# EAGLE design miniFlyportProgrammer (EAGLE 6.4)
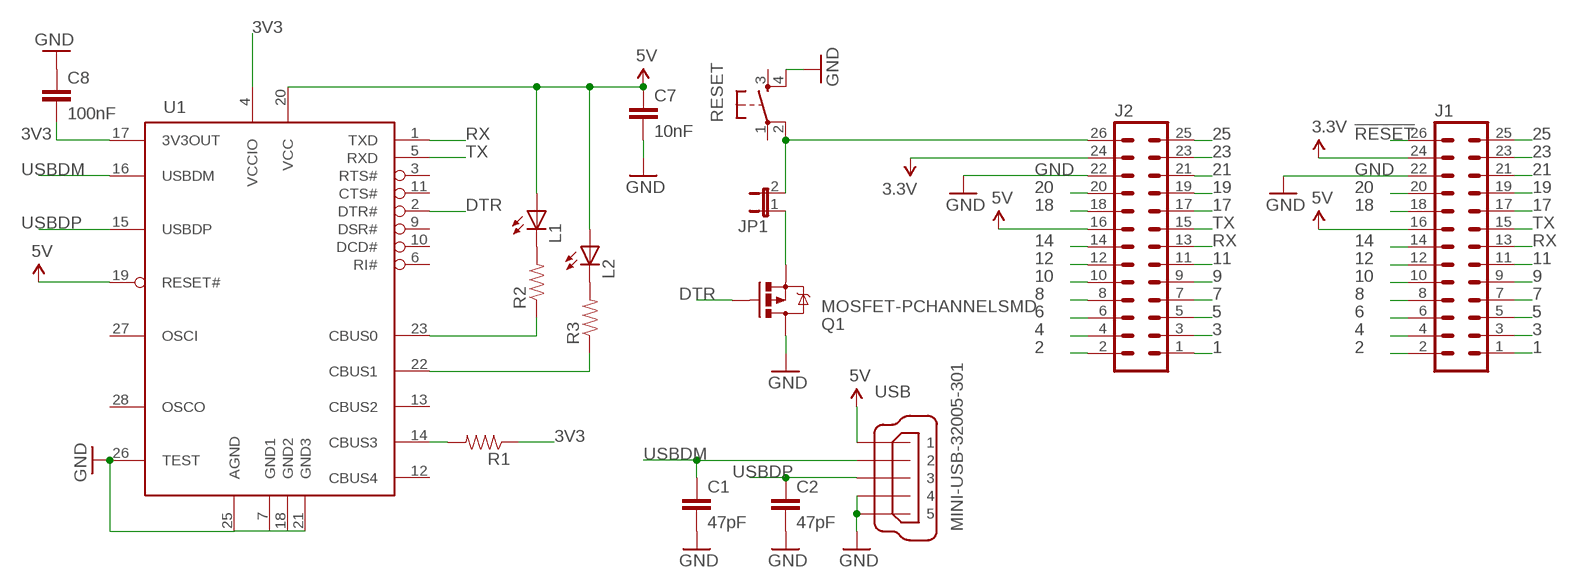
[diagram p0: schematic, sheet 1]

## Parts
C1  47pF  C-EUC0603  [C0603]
C2  47pF  C-EUC0603  [C0603]
C7  10nF  C-EUC0603  [C0603]
C8  100nF  C-EUC0603  [C0603]
J1  MA13-2  [MA13-2]
J2  MA13-2  [MA13-2]
JP1  JUMPER-2PTH  [1X02]
L1  LED0603  [LED-0603]
L2  LED0603  [LED-0603]
Q1  MOSFET-PCHANNELSMD  [SOT23-3]
R1  RESISTOR0603-RES  [0603-RES]
R2  RESISTOR0603-RES  [0603-RES]
R3  RESISTOR0603-RES  [0603-RES]
RESET  TAC_SWITCHSMD  [TACTILE_SWITCH_SMD]
U1  FT232RL  [SSOP28DB]
USB  MINI-USB-32005-301  [32005-301]

## Nets
1: J1.1 J2.1
2: J1.2 J2.2
3: J1.3 J2.3
3.3V: J1.24 J2.24
3V3: C8.2 R1.1 U1.4(VCCIO) U1.17(3V3OUT)
4: J1.4 J2.4
5: J1.5 J2.5
5V: C7.1 J1.16 J2.16 L1.A L2.A U1.19(RESET#) U1.20(VCC) USB.1
6: J1.6 J2.6
7: J1.7 J2.7
8: J1.8 J2.8
9: J1.9 J2.9
10: J1.10 J2.10
11: J1.11 J2.11
12: J1.12 J2.12
14: J1.14 J2.14
17: J1.17 J2.17
18: J1.18 J2.18
19: J1.19 J2.19
20: J1.20 J2.20
21: J1.21 J2.21
23: J1.23 J2.23
25: J1.25 J2.25
!RESET: J1.26 J2.26 JP1.2 RESET.2
DTR: Q1.1(G) U1.2(DTR#)
GND: C1.2 C2.2 C7.2 C8.1 J1.22 J2.22 Q1.3(D) RESET.4 U1.7(GND1) U1.18(GND2) U1.21(GND3) U1.25(AGND) U1.26(TEST) USB.4 USB.5
N$1: JP1.1 Q1.2(S)
N$5: L1.C R2.2
N$6: L2.C R3.2
N$8: R1.2 U1.14(CBUS3)
N$13: R2.1 U1.23(CBUS0)
N$15: R3.1 U1.22(CBUS1)
RX: J1.13 J2.13 U1.1(TXD)
TX: J1.15 J2.15 U1.5(RXD)
USBDM: C1.1 U1.16(USBDM) USB.2
USBDP: C2.1 U1.15(USBDP) USB.3
Unconnected: RESET.1 RESET.3 U1.3(RTS#) U1.6(RI#) U1.9(DSR#) U1.10(DCD#) U1.11(CTS#) U1.12(CBUS4) U1.13(CBUS2) U1.27(OSCI) U1.28(OSCO)

## Library data of the parts
C1 C2 C7 C8 = resistor:C-EU: CAPACITOR, European symbol
J1 J2 = con-lstb:MA13-2: PIN HEADER
JP1 = SparkFun-Passives:JUMPER-2: Jumper Basic 0.1" spaced jumper. Use with breakaway headers.
L1 L2 = SparkFun-LED:LED: LEDs Standard schematic elements and footprints for 5mm, 3mm, 1206, and 0603 sized LEDs. 5mm - Spark Fun Electronics SKU : COM-00529 (and others)
Q1 = SparkFun-DiscreteSemi:MOSFET-PCHANNEL: Generic PMOSFET
R1-R3 = SparkFun-Passives:RESISTOR: Resistor Basic schematic elements and footprints for 0603, 1206, and PTH resistors.
RESET = SparkFun-Electromechanical:TAC_SWITCH: Momentary Switch Button commonly used for reset or general input. Spark Fun Electronics SKU : COM-00097
U1 = ftdichip-4:FT232RL: USB UART 4th Generation USB UART (USB <-> Serial) Controller
USB = con-cypressindustries:MINI-USB-: MINI USB-B Conector Source: www.cypressindustries.com

## Board
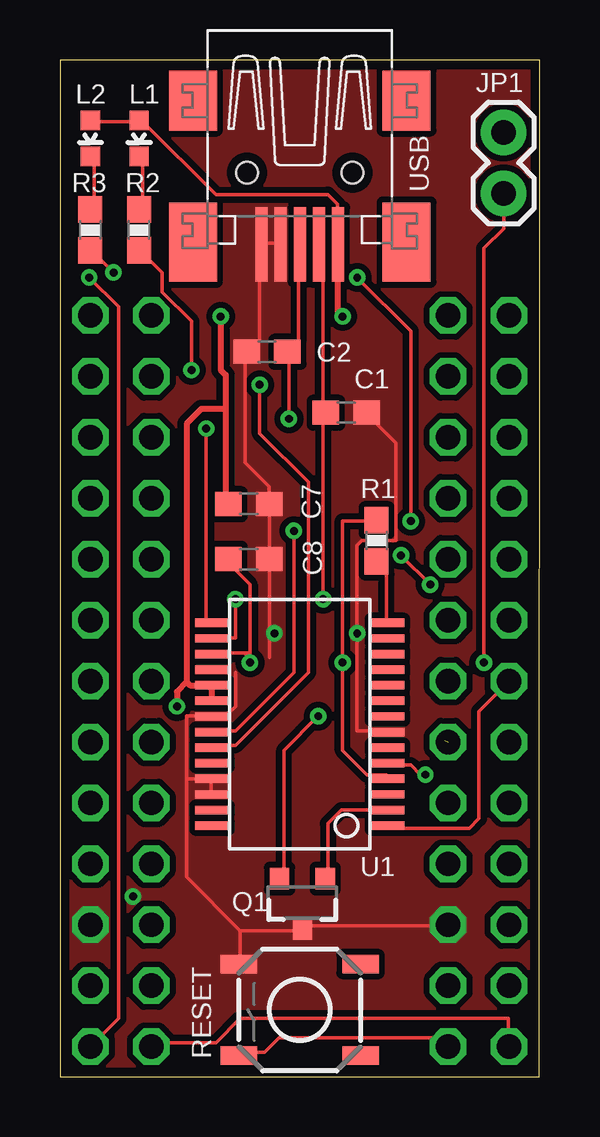
[diagram p1: board, top side]
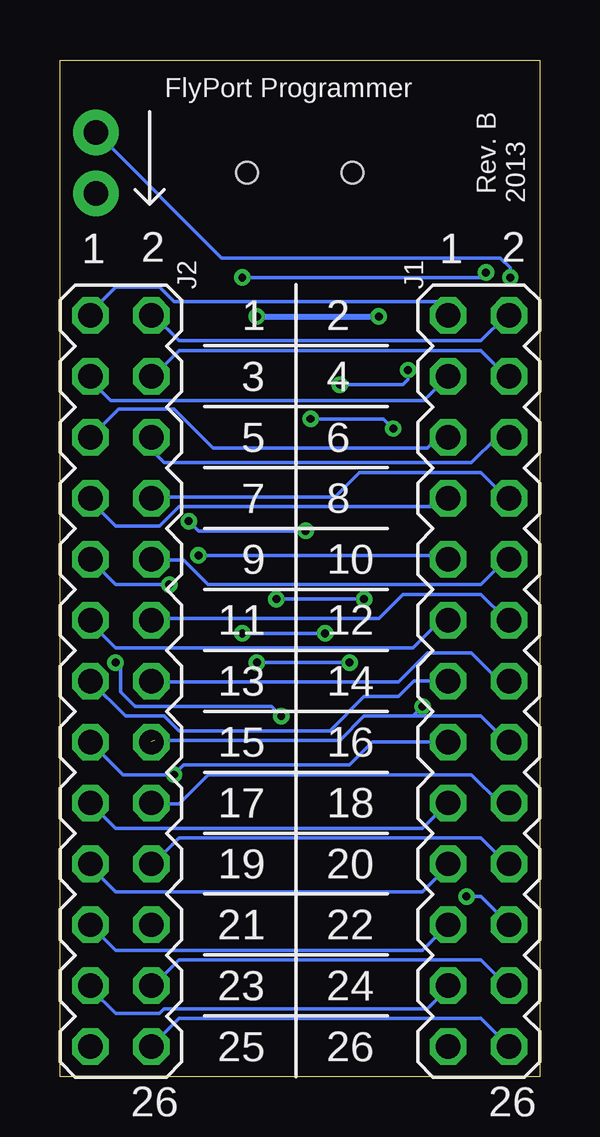
[diagram p2: board, bottom side, seen from below]

Size 20 x 42.39 mm. Coordinates in mm from the lower left corner, seen from the top.
Outline: 0,0 19.99,0 20,42.39 0,42.39 0,0
Copper layers (1*16): Top 0.0356mm / dielectric 1.5011mm / Bottom 0.0356mm
Design rules "LaenPCBOrder *": minimum track width 6mil, minimum drill 13mil, track to track 6mil, track to pad 6mil, pad to pad 6mil, via to via 6mil, smd to smd 6mil, copper to edge 15mil, drill to drill 6mil, minimum pad ring 7mil, minimum via ring 7mil, stop-mask expansion 4mil, vias tented up to drill 15mil, thermal gap 10mil

### Footprints (pad centres in the part's own frame; a part is rotated, then mirrored left to right if it is on the bottom)
C0603 = smd 1.1 x 1: 1 -0.85,0; 2 0.85,0
MA13-2 = drill 1.016 octagon: 1 -15.24,-1.27; 2 -15.24,1.27; 3 -12.7,-1.27; 4 -12.7,1.27; 5 -10.16,-1.27; 6 -10.16,1.27; 7 -7.62,-1.27; 8 -7.62,1.27; 9 -5.08,-1.27; 10 -5.08,1.27; 11 -2.54,-1.27; 12 -2.54,1.27; 13 0,-1.27; 14 0,1.27; 15 2.54,-1.27; 16 2.54,1.27; 17 5.08,-1.27; 18 5.08,1.27; 19 7.62,-1.27; 20 7.62,1.27; 21 10.16,-1.27; 22 10.16,1.27; 23 12.7,-1.27; 24 12.7,1.27; 25 15.24,-1.27; 26 15.24,1.27
1X02 = drill 1.016 pad 1.88: 1 0,0; 2 2.54,0
LED-0603 = smd 0.8 x 0.8: A 0,-0.75; C 0,0.75
SOT23-3 = smd 0.8 x 0.9: 1 -0.95,-1; 2 0.95,-1; 3 0,1.1
0603-RES = smd 1.1 x 1: 1 -0.85,0; 2 0.85,0
TACTILE_SWITCH_SMD = smd 1.524 x 0.762: 1 -2.54,1.905; 2 2.54,1.905; 3 -2.54,-1.905; 4 2.54,-1.905
SSOP28DB = smd 0.348 x 1.397: 1 -4.225,-3.656; 2 -3.575,-3.656; 3 -2.925,-3.656; 4 -2.275,-3.656; 5 -1.625,-3.656; 6 -0.975,-3.656; 7 -0.325,-3.656; 8 0.325,-3.656; 9 0.975,-3.656; 10 1.625,-3.656; 11 2.275,-3.656; 12 2.925,-3.656; 13 3.575,-3.656; 14 4.225,-3.656; 15 4.225,3.656; 16 3.575,3.656; 17 2.925,3.656; 18 2.275,3.656; 19 1.625,3.656; 20 0.975,3.656; 21 0.325,3.656; 22 -0.325,3.656; 23 -0.975,3.656; 24 -1.625,3.656; 25 -2.275,3.656; 26 -2.925,3.656; 27 -3.575,3.656; 28 -4.225,3.656
32005-301 = smd 3.1 x 0.5: 1 3,1.6; 2 3,0.8; 3 3,0; 4 3,-0.8; 5 3,-1.6 | smd 2.5 x 2: M1 -3,-4.45; M2 -3,4.45 | smd 3.3 x 2: M3 2.9,4.45; M4 2.9,-4.45 | hole 0.9: 0,2.2; 0,-2.2

### Placement (x,y rotation side)
C1  11.94,27.69 0 top
C2  8.64,30.23 180 top
C7  7.87,23.88 0 top
C8  7.87,21.59 180 top
J1  2.54,16.5 270 bottom
J2  17.46,16.5 270 bottom
JP1  18.5,36.83 90 top
L1  3.3,39.12 180 top
L2  1.27,39.12 180 top
Q1  10.11,7.26 180 top
R1  13.21,22.35 270 top
R2  3.3,35.31 90 top
R3  1.27,35.31 90 top
RESET  10,2.79 180 top
U1  10,14.7 90 top
USB  10,37.7 270 top

### Tracks (layer width: path | path; a pad name or v marks a point on that pad's centre or on a via)
1
  Bottom 0.152: J1.1 3.86,31.9 4.27,32.31 15.24,32.31 15.85,32.92 17.68,32.92 18.69,31.9 J2.1
2
  Bottom 0.152: J1.2 1.42,31.7 2.44,30.68 15.04,30.68 16.05,31.7 J2.2
3
  Bottom 0.152: J1.3 4.76,28.25 4.76,28.19 17.88,28.19 18.73,29.04 J2.3
3.3V
  Bottom 0.152: J1.24 1.42,3.86 2.44,4.88 15.04,4.88 16.05,3.86 J2.24
3V3  (via drill 0.33)
  Top 0.152: 7.72,17.68 6.5,17.68 U1.17 | C8.2 7.11,21.54 7.11,21.34 7.92,20.52 v7.92,17.27 7.72,17.68 | R1.1 13.21,23.16 11.79,23.16 v11.79,17.27 11.79,13.61 12.8,12.6 13.61,12.6 U1.4 | 7.92,17.68 7.72,17.68
  Bottom 0.152: v11.79,17.27 v7.92,17.27
4
  Bottom 0.152: J1.4 1.42,29.26 2.44,30.28 15.04,30.28 16.05,29.26 J2.4
5
  Bottom 0.152: J1.5 4.23,26.66 4.67,26.21 13.61,26.21 15.24,27.84 17.55,27.84 J2.5
5V  (via drill 0.33)  (1 unrouted)
  Top 0.152: 6.3,15.65 U1.20 | L2.A 1.42,39.83 3.25,39.83 L1.A 3.45,39.83 6.5,36.78 11.18,36.78 11.58,36.37 11.58,34.72 USB.1 11.58,34.75 | 6.91,23.98 C7.1
  Top 0.254: 6.91,27.84 6.91,29.26 6.71,29.46 v6.71,31.7 | 6.91,27.84 6.91,23.98 | 5.28,16.46 5.28,27.23 5.89,27.84 6.91,27.84 | v4.88,15.44 4.88,16.05 5.28,16.46 | 11.58,34.75 11.58,31.9 v11.79,31.7 | 5.28,16.46 5.42,16.32 U1.19 U1.20
  Bottom 0.152: 16.05,14.02 8.33,14.02 7.32,15.04 5.28,15.04 | J1.16 1.42,14.02 2.44,15.04 5.28,15.04 | 5.28,15.04 v4.88,15.44
  Bottom 0.254: v11.79,31.7 v6.71,31.7
6
  Bottom 0.152: J1.6 1.79,26.66 2.85,25.6 15.65,25.6 16.05,26.01 16.05,26.52 J2.6
7
  Bottom 0.152: J1.7 3.86,23.98 4.06,23.77 15.04,23.77 15.85,22.96 17.68,22.96 18.69,23.98 J2.7
8
  Bottom 0.152: J1.8 1.42,24.18 2.44,25.2 7.52,25.2 8.53,24.18 16.05,24.18 J2.8
9  (via drill 0.33)
  Top 0.152: v15.44,20.52 v14.22,21.74
  Bottom 0.152: v14.22,21.74 3.86,21.74 J1.9 | v15.44,20.52 17.68,20.52 18.69,21.54 J2.9
10
  Bottom 0.152: J1.10 1.42,21.54 2.44,20.52 13.82,20.52 14.83,21.54 16.05,21.54 J2.10
11
  Bottom 0.152: J1.11 4.27,18.9 5.28,17.88 17.68,17.88 18.69,18.9 J2.11
12
  Bottom 0.152: J1.12 1.42,19.1 2.44,20.12 5.69,20.12 6.71,19.1 16.05,19.1 J2.12
14
  Bottom 0.152: J1.14 1.42,16.46 1.63,16.46 2.85,17.68 4.67,17.68 5.89,16.46 16.05,16.46 J2.14
17
  Bottom 0.152: J1.17 3.86,11.38 4.88,10.36 17.68,10.36 18.69,11.38 J2.17
18
  Bottom 0.152: J1.18 1.67,11.42 2.85,12.6 13.82,12.6 15.04,11.38 16.15,11.38 J2.18
19
  Bottom 0.152: J1.19 3.86,8.74 4.88,7.72 17.68,7.72 18.69,8.74 J2.19
20
  Bottom 0.152: J1.20 1.42,8.94 2.44,9.96 15.04,9.96 16.05,8.94 J2.20
21
  Bottom 0.152: J1.21 3.86,6.3 4.88,5.28 17.68,5.28 18.69,6.3 J2.21
23
  Bottom 0.152: J1.23 3.86,3.66 4.67,2.85 15.65,2.85 15.85,2.64 17.68,2.64 18.69,3.66 J2.23
25
  Top 0.152: J1.25 3.86,1.42 6.5,1.42 7.52,2.44 18.69,2.44 18.69,1.42 J2.25
!RESET  (via drill 0.33)
  Top 0.152: 7.52,1.02 RESET.2 7.59,1.02 8.53,1.02 9.14,1.63 16.05,1.63 16.05,1.42 J2.26 | v1.22,33.33 2.44,32.11 2.44,2.44 1.42,1.42 J1.26
  Bottom 0.152: J2.26 16.05,1.42 15.04,2.44 2.44,2.44 1.42,1.42 J1.26 | JP1.2 13.27,34.14 1.63,34.14 1.22,33.73 v1.22,33.33
DTR
  Top 0.152: Q1.1 11.18,8.38 11.18,10.57 11.73,11.12 U1.2
GND  (via drill 0.33)
  Top 0.152: 7.52,6.1 9.96,6.1 Q1.3 10.16,6.3 16.05,6.3 J2.22 | 7.52,6.1 7.52,4.88 RESET.4 | U1.7 13.61,14.43 12.39,14.43 v12.39,18.49 12.39,22.15 12.6,22.35 14.02,22.35 14.02,26.42 12.8,27.64 C1.2 | 9.14,34.75 8.53,34.75 USB.5 8.33,34.54 8.33,30.68 7.92,30.28 C2.2 7.72,30.07 7.72,25.6 8.72,24.6 C7.2 | C7.2 8.74,23.77 8.74,21.74 C8.1 8.74,21.54 8.74,18.49 | 6.3,12.39 U1.25 | U1.26 6.3,11.79 6.3,12.38 U1.25 | 7.32,16.87 7.32,15.44 6.91,15.04 6.5,15.04 U1.21 6.3,15.04 5.28,15.04 5.28,12.39 | 6.5,16.87 U1.18 | 8.74,17.48 8.74,18.49 | 8.74,23.98 C7.2 | 8.74,18.49 v8.94,18.49 | 7.52,6.1 5.28,8.33 5.28,12.39 | U1.25 5.31,12.43 5.28,12.39
  Bottom 0.152: J1.22 1.42,6.5 2.44,7.52 v3.05,7.52 | v8.94,18.49 v12.39,18.49
  pour Top (isolate 0.254, no thermals): 0,0 0,42.52 20.32,42.52 20.32,0
N$1  (via drill 0.33)
  Top 0.152: v17.68,17.27 17.68,34.54 18.5,35.37 JP1.1 | Q1.2 9.35,8.33 9.35,13.61 v10.77,15.04
  Bottom 0.152: v10.77,15.04 11.18,15.44 16.87,15.44 17.48,16.05 17.48,17.07 v17.68,17.27
N$5
  Top 0.152: L1.C 3.45,38.2 3.45,36.17 R2.2
N$6
  Top 0.152: L2.C 1.42,38.2 1.42,36.17 R3.2
N$8
  Top 0.152: R1.2 13.21,21.34 13.61,20.93 13.61,18.9 U1.14
N$13  (via drill 0.33)
  Top 0.152: v5.49,29.46 5.49,31.5 4.27,32.72 4.27,33.53 3.45,34.34 R2.1 | v8.33,28.85 8.33,26.82 10.36,24.79 10.36,16.87 7.32,13.82 6.5,13.82 U1.23
  Bottom 0.152: v8.33,28.85 5.69,28.85 5.49,29.06 v5.49,29.46
N$15  (via drill 0.33)
  Top 0.152: v2.23,33.53 1.42,34.34 R3.1 | v12.39,33.33 14.63,31.09 v14.63,23.16 | v9.75,22.76 9.75,16.87 7.32,14.43 6.5,14.43 U1.22
  Bottom 0.152: v2.23,33.53 2.44,33.33 v12.39,33.33 | v14.63,23.16 14.22,22.76 v9.75,22.76
RX
  Top 0.152: U1.1 13.82,10.36 17.07,10.36 17.48,10.77 17.48,15.24 18.69,16.46 J2.13
  Bottom 0.152: J1.13 5.24,16.5 5.89,15.85 7.32,15.85 8.74,14.43 15.04,14.43 15.65,15.04 17.27,15.04 J2.13
TX  (via drill 0.33)
  Top 0.152: U1.5 13.82,13.01 14.63,13.01 15.04,12.6 v15.24,12.6
  Bottom 0.152: J2.15 17.37,12.6 v15.24,12.6 14.83,13.01 7.92,13.01 6.97,13.96 J1.15
USBDM  (via drill 0.33)
  Top 0.152: v7.32,19.91 7.32,18.29 6.5,18.29 U1.16 | v10.97,19.91 10.97,27.64 C1.1 10.97,27.84 10.97,34.54 USB.2
  Bottom 0.152: v10.97,19.91 v7.32,19.91
USBDP  (via drill 0.33)
  Top 0.152: v6.1,27.03 6.1,19.1 6.3,18.9 U1.15 | v9.55,27.43 9.55,30.07 C2.1 | 9.75,30.48 9.55,30.28 C2.1 | USB.3 9.96,34.54 9.96,30.7 C2.1
  Bottom 0.152: v6.1,27.03 6.5,27.43 v9.55,27.43

### Text on the board
bNames: FlyPort Programmer | Rev. B | 2013 | 2 | 2 | 2 | 1 | 4 | 3 | 6 | 5 | 8 | 7 | 10 | 9 | 12 | 11 | 14 | 13 | 16 | 15 | 18 | 17 | 20 | 19 | 22 | 21 | 24 | 23 | 26 | 25